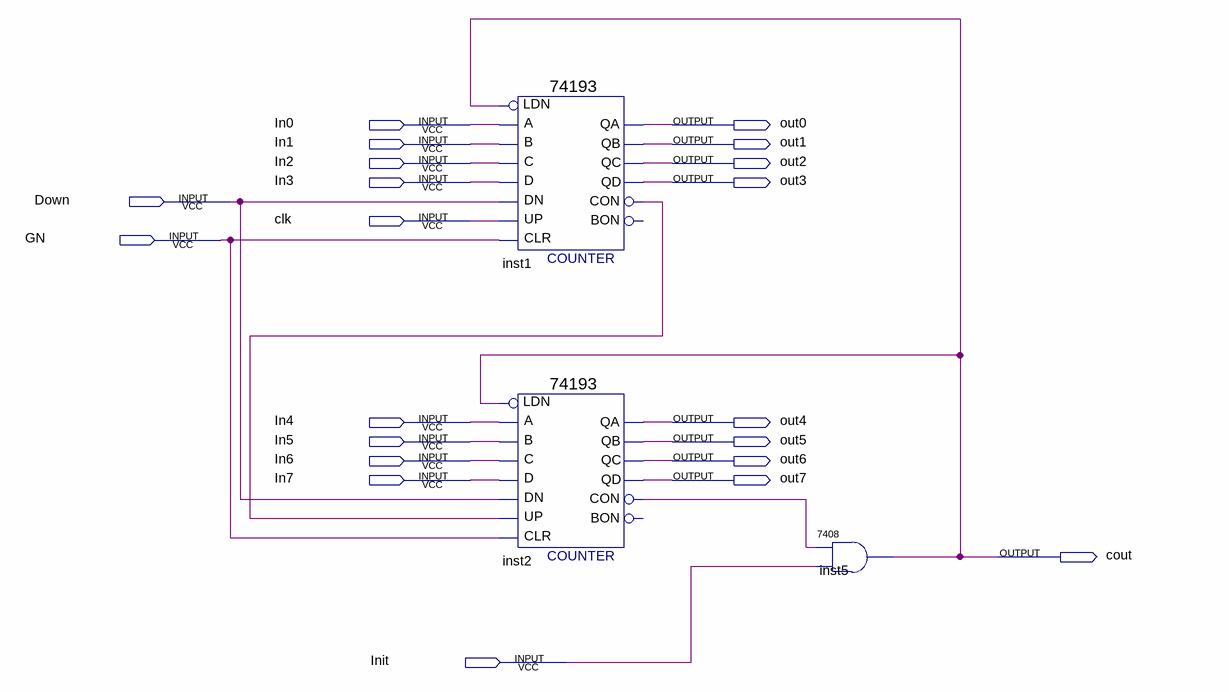
[diagram p0: schematic sheet]
// Quartus schematic counterDivider.bdf as structural Verilog: 3 symbols, 21 pins
module counterDivider (
  input  In0,
  input  In1,
  input  In2,
  input  In3,
  input  Down,
  input  clk,
  input  GN,
  input  In4,
  input  In5,
  input  In6,
  input  In7,
  input  Init,
  output out0,
  output out1,
  output out2,
  output out3,
  output out4,
  output out5,
  output out6,
  output out7,
  output cout
);

  wire inst1_con, inst2_con;

  \74193  inst1 (
    .D(In3), .C(In2), .B(In1), .A(In0), .CLR(GN), .UP(clk), .DN(Down), .LDN(cout), .QB(out1), .QA(out0),
    .CON(inst1_con), .QD(out3), .QC(out2));  // open: BON
  \74193  inst2 (
    .D(In7), .C(In6), .B(In5), .A(In4), .CLR(GN), .UP(inst1_con), .DN(Down), .LDN(cout), .QB(out5),
    .QA(out4), .CON(inst2_con), .QD(out7), .QC(out6));  // open: BON
  \7408  inst5 (.\3 (Init), .\2 (inst2_con), .\1 (cout));
endmodule
